# Altium schematic sheet 05) SAMA5D27SOM.SchDoc
size B; CompanyName: Microchip Technology Inc.; Organization: Microchip Technology; Address1: 2355 West Chandler Blvd.; Address2: Chandler, AZ  85224; Address4: USA; DocumentNumber: 5; SheetNumber: 5; SheetTotal: 9; SheetTitle: **; Time: Time
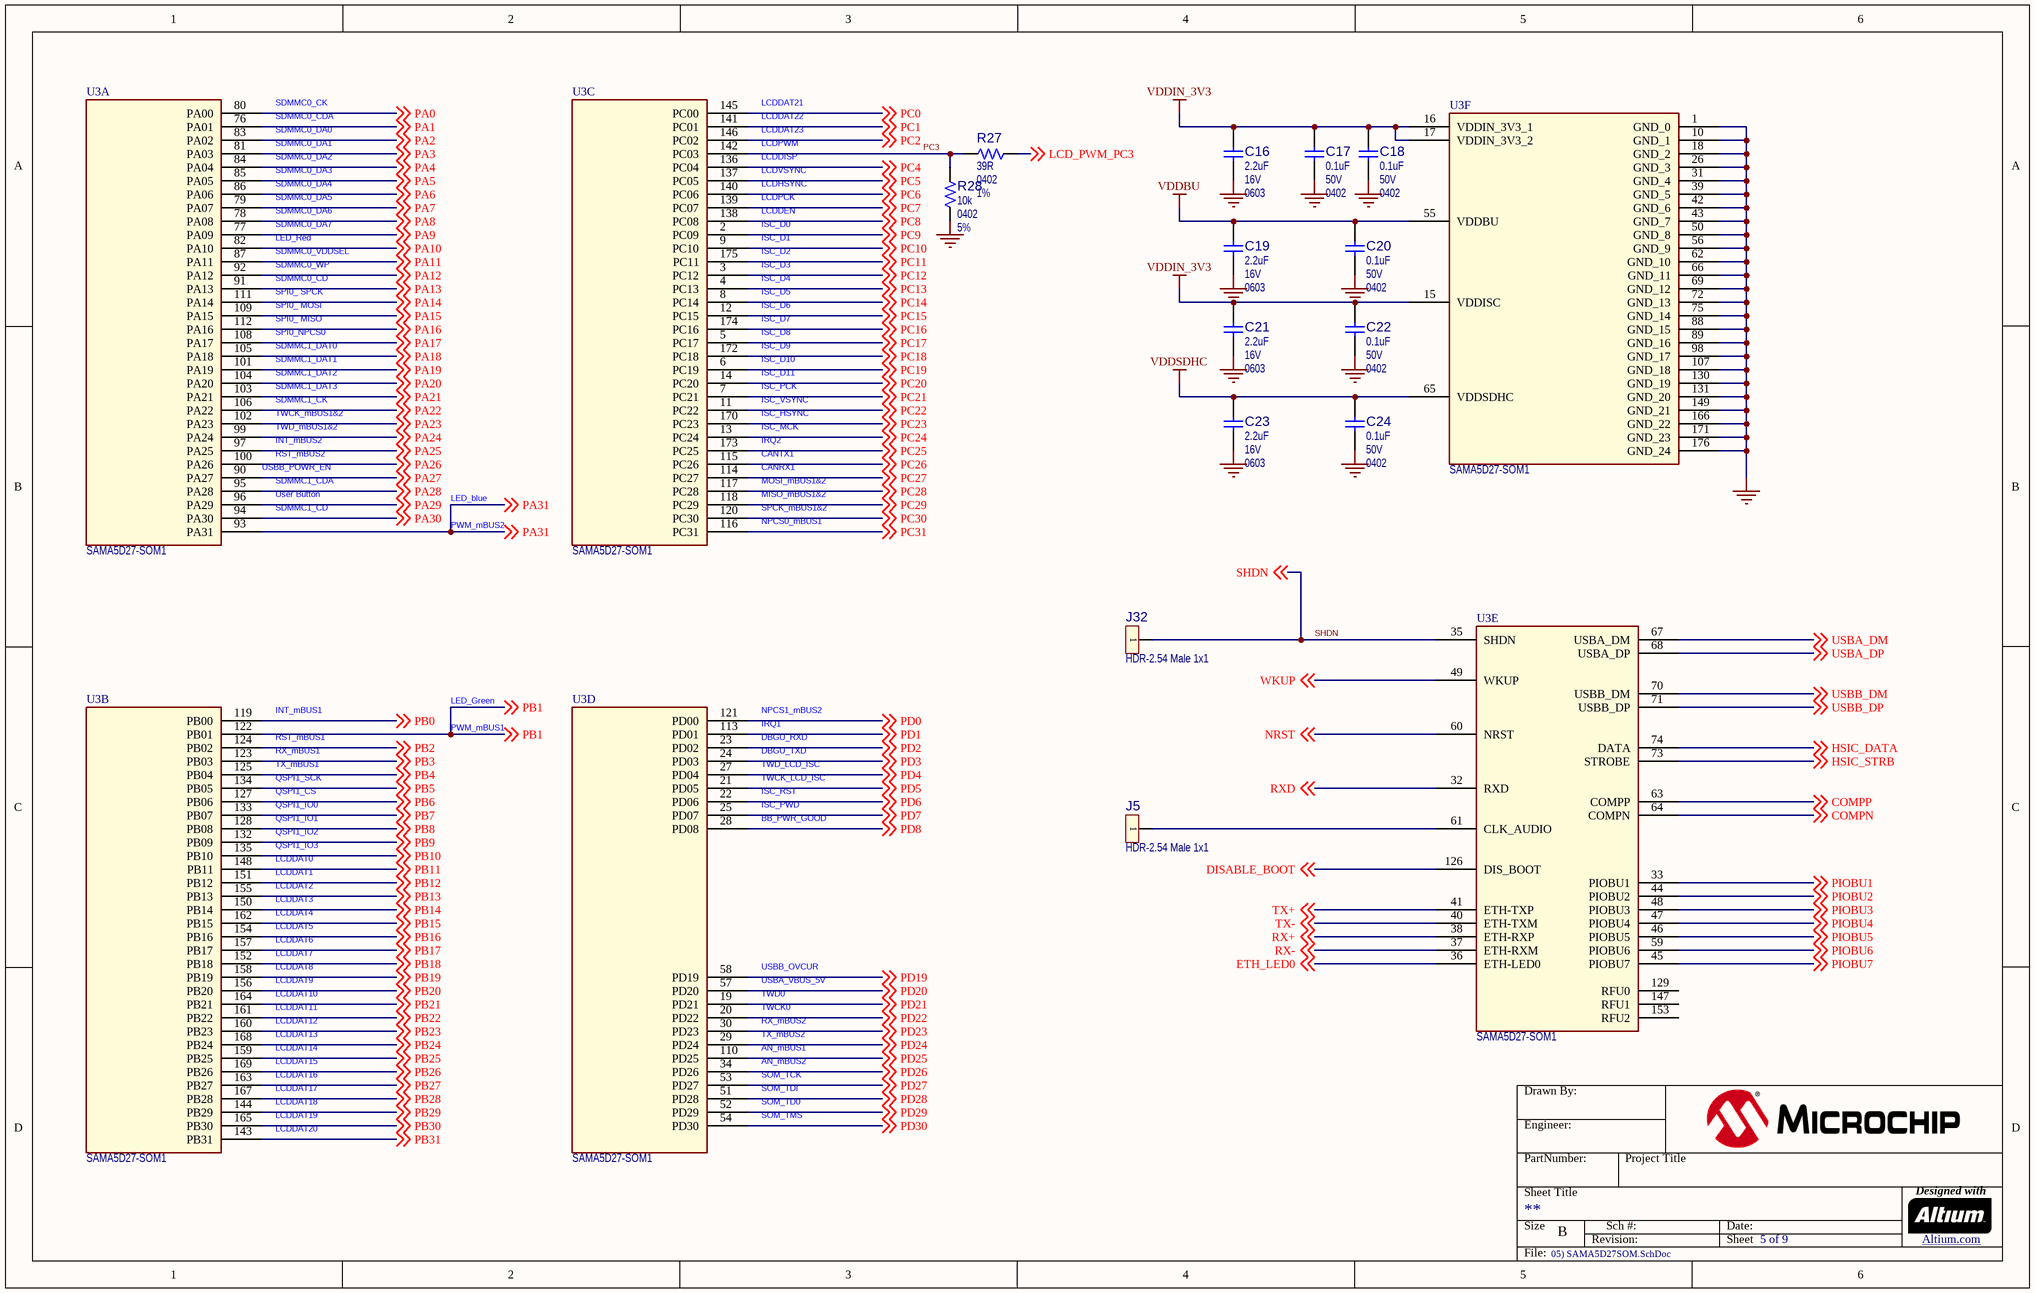
[diagram p0: 05) SAMA5D27SOM.SchDoc]

## Parts
?  (no value)  (graphical)
C16  value 2.2uF  Voltage: 16V  Package: 0603  [CAP_C_0603]  (hidden comment: Capacitor NP)
C17  value 0.1uF  Voltage: 50V  Package: 0402  [CAP_C_0402]  (hidden comment: Capacitor NP)
C18  value 0.1uF  Voltage: 50V  Package: 0402  [CAP_C_0402]  (hidden comment: Capacitor NP)
C19  value 2.2uF  Voltage: 16V  Package: 0603  [CAP_C_0603]  (hidden comment: Capacitor NP)
C20  value 0.1uF  Voltage: 50V  Package: 0402  [CAP_C_0402]  (hidden comment: Capacitor NP)
C21  value 2.2uF  Voltage: 16V  Package: 0603  [CAP_C_0603]  (hidden comment: Capacitor NP)
C22  value 0.1uF  Voltage: 50V  Package: 0402  [CAP_C_0402]  (hidden comment: Capacitor NP)
C23  value 2.2uF  Voltage: 16V  Package: 0603  [CAP_C_0603]  (hidden comment: Capacitor NP)
C24  value 0.1uF  Voltage: 50V  Package: 0402  [CAP_C_0402]  (hidden comment: Capacitor NP)
J5  value HDR-2.54 Male 1x1  [HDR_M_2.54_1x1]  (hidden comment: Header 1x1)
J32  value HDR-2.54 Male 1x1  [HDR_M_2.54_1x1]  (hidden comment: Header 1x1)
R27  value 39R  Package: 0402  Tolerance: 1%  [RES_C_0402]  (hidden comment: Resistor)
R28  value 10k  Package: 0402  Tolerance: 5%  [RES_C_0402]  (hidden comment: Resistor)
U3  value SAMA5D27-SOM1  [MOD SOM SAMA5D27-SOM1 40MMX38MM]  (hidden comment: *)  (parts A,B,C,D,E,F of 6)

## Nets
GND_POWER: C16.2 C17.2 C18.2 C19.2 C20.2 C21.2 C22.2 C23.2 C24.2 R28.2 U3.1(GND_0) U3.10(GND_1) U3.18(GND_2) U3.26(GND_3) U3.31(GND_4) U3.39(GND_5) U3.42(GND_6) U3.43(GND_7) U3.50(GND_8) U3.56(GND_9) U3.62(GND_10) U3.66(GND_11) U3.69(GND_12) U3.72(GND_13) U3.75(GND_14) U3.88(GND_15) U3.89(GND_16) U3.98(GND_17) U3.107(GND_18) U3.130(GND_19) U3.131(GND_20) U3.149(GND_21) U3.166(GND_22) U3.171(GND_23) U3.176(GND_24)
VDDBU: C19.1 C20.1 U3.55(VDDBU)
VDDIN_3V3: C16.1 C17.1 C18.1 C21.1 C22.1 U3.15(VDDISC) U3.16(VDDIN_3V3_1) U3.17(VDDIN_3V3_2)
VDDSDHC: C23.1 C24.1 U3.65(VDDSDHC)
COMPN: U3.64(COMPN) ; off-sheet COMPN
COMPP: U3.63(COMPP) ; off-sheet COMPP
DISABLE_BOOT: U3.126(DIS_BOOT) ; off-sheet DISABLE_BOOT
ETH_LED0: U3.36(ETH-LED0) ; off-sheet ETH_LED0
HSIC_DATA: U3.74(DATA) ; off-sheet HSIC_DATA
HSIC_STRB: U3.73(STROBE) ; off-sheet HSIC_STRB
LCD_PWM_PC3: R27.2 ; off-sheet LCD_PWM_PC3
NRST: U3.60(NRST) ; off-sheet NRST
PA0: U3.80(PA00) ; off-sheet PA0
PA1: U3.76(PA01) ; off-sheet PA1
PA2: U3.83(PA02) ; off-sheet PA2
PA3: U3.81(PA03) ; off-sheet PA3
PA4: U3.84(PA04) ; off-sheet PA4
PA5: U3.85(PA05) ; off-sheet PA5
PA6: U3.86(PA06) ; off-sheet PA6
PA7: U3.79(PA07) ; off-sheet PA7
PA8: U3.78(PA08) ; off-sheet PA8
PA9: U3.77(PA09) ; off-sheet PA9
PA10: U3.82(PA10) ; off-sheet PA10
PA11: U3.87(PA11) ; off-sheet PA11
PA12: U3.92(PA12) ; off-sheet PA12
PA13: U3.91(PA13) ; off-sheet PA13
PA14: U3.111(PA14) ; off-sheet PA14
PA15: U3.109(PA15) ; off-sheet PA15
PA16: U3.112(PA16) ; off-sheet PA16
PA17: U3.108(PA17) ; off-sheet PA17
PA18: U3.105(PA18) ; off-sheet PA18
PA19: U3.101(PA19) ; off-sheet PA19
PA20: U3.104(PA20) ; off-sheet PA20
PA21: U3.103(PA21) ; off-sheet PA21
PA22: U3.106(PA22) ; off-sheet PA22
PA23: U3.102(PA23) ; off-sheet PA23
PA24: U3.99(PA24) ; off-sheet PA24
PA25: U3.97(PA25) ; off-sheet PA25
PA26: U3.100(PA26) ; off-sheet PA26
PA27: U3.90(PA27) ; off-sheet PA27
PA28: U3.95(PA28) ; off-sheet PA28
PA29: U3.96(PA29) ; off-sheet PA29
PA30: U3.94(PA30) ; off-sheet PA30
PA31: U3.93(PA31) ; off-sheet PA31
PB0: U3.119(PB00) ; off-sheet PB0
PB1: U3.122(PB01) ; off-sheet PB1
PB2: U3.124(PB02) ; off-sheet PB2
PB3: U3.123(PB03) ; off-sheet PB3
PB4: U3.125(PB04) ; off-sheet PB4
PB5: U3.134(PB05) ; off-sheet PB5
PB6: U3.127(PB06) ; off-sheet PB6
PB7: U3.133(PB07) ; off-sheet PB7
PB8: U3.128(PB08) ; off-sheet PB8
PB9: U3.132(PB09) ; off-sheet PB9
PB10: U3.135(PB10) ; off-sheet PB10
PB11: U3.148(PB11) ; off-sheet PB11
PB12: U3.151(PB12) ; off-sheet PB12
PB13: U3.155(PB13) ; off-sheet PB13
PB14: U3.150(PB14) ; off-sheet PB14
PB15: U3.162(PB15) ; off-sheet PB15
PB16: U3.154(PB16) ; off-sheet PB16
PB17: U3.157(PB17) ; off-sheet PB17
PB18: U3.152(PB18) ; off-sheet PB18
PB19: U3.158(PB19) ; off-sheet PB19
PB20: U3.156(PB20) ; off-sheet PB20
PB21: U3.164(PB21) ; off-sheet PB21
PB22: U3.161(PB22) ; off-sheet PB22
PB23: U3.160(PB23) ; off-sheet PB23
PB24: U3.168(PB24) ; off-sheet PB24
PB25: U3.159(PB25) ; off-sheet PB25
PB26: U3.169(PB26) ; off-sheet PB26
PB27: U3.163(PB27) ; off-sheet PB27
PB28: U3.167(PB28) ; off-sheet PB28
PB29: U3.144(PB29) ; off-sheet PB29
PB30: U3.165(PB30) ; off-sheet PB30
PB31: U3.143(PB31) ; off-sheet PB31
PC0: U3.145(PC00) ; off-sheet PC0
PC1: U3.141(PC01) ; off-sheet PC1
PC2: U3.146(PC02) ; off-sheet PC2
PC3: R27.1 R28.1 U3.142(PC03)
PC4: U3.136(PC04) ; off-sheet PC4
PC5: U3.137(PC05) ; off-sheet PC5
PC6: U3.140(PC06) ; off-sheet PC6
PC7: U3.139(PC07) ; off-sheet PC7
PC8: U3.138(PC08) ; off-sheet PC8
PC9: U3.2(PC09) ; off-sheet PC9
PC10: U3.9(PC10) ; off-sheet PC10
PC11: U3.175(PC11) ; off-sheet PC11
PC12: U3.3(PC12) ; off-sheet PC12
PC13: U3.4(PC13) ; off-sheet PC13
PC14: U3.8(PC14) ; off-sheet PC14
PC15: U3.12(PC15) ; off-sheet PC15
PC16: U3.174(PC16) ; off-sheet PC16
PC17: U3.5(PC17) ; off-sheet PC17
PC18: U3.172(PC18) ; off-sheet PC18
PC19: U3.6(PC19) ; off-sheet PC19
PC20: U3.14(PC20) ; off-sheet PC20
PC21: U3.7(PC21) ; off-sheet PC21
PC22: U3.11(PC22) ; off-sheet PC22
PC23: U3.170(PC23) ; off-sheet PC23
PC24: U3.13(PC24) ; off-sheet PC24
PC25: U3.173(PC25) ; off-sheet PC25
PC26: U3.115(PC26) ; off-sheet PC26
PC27: U3.114(PC27) ; off-sheet PC27
PC28: U3.117(PC28) ; off-sheet PC28
PC29: U3.118(PC29) ; off-sheet PC29
PC30: U3.120(PC30) ; off-sheet PC30
PC31: U3.116(PC31) ; off-sheet PC31
PD0: U3.121(PD00) ; off-sheet PD0
PD1: U3.113(PD01) ; off-sheet PD1
PD2: U3.23(PD02) ; off-sheet PD2
PD3: U3.24(PD03) ; off-sheet PD3
PD4: U3.27(PD04) ; off-sheet PD4
PD5: U3.21(PD05) ; off-sheet PD5
PD6: U3.22(PD06) ; off-sheet PD6
PD7: U3.25(PD07) ; off-sheet PD7
PD8: U3.28(PD08) ; off-sheet PD8
PD19: U3.58(PD19) ; off-sheet PD19
PD20: U3.57(PD20) ; off-sheet PD20
PD21: U3.19(PD21) ; off-sheet PD21
PD22: U3.20(PD22) ; off-sheet PD22
PD23: U3.30(PD23) ; off-sheet PD23
PD24: U3.29(PD24) ; off-sheet PD24
PD25: U3.110(PD25) ; off-sheet PD25
PD26: U3.34(PD26) ; off-sheet PD26
PD27: U3.53(PD27) ; off-sheet PD27
PD28: U3.51(PD28) ; off-sheet PD28
PD29: U3.52(PD29) ; off-sheet PD29
PD30: U3.54(PD30) ; off-sheet PD30
PIOBU1: U3.33(PIOBU1) ; off-sheet PIOBU1
PIOBU2: U3.44(PIOBU2) ; off-sheet PIOBU2
PIOBU3: U3.48(PIOBU3) ; off-sheet PIOBU3
PIOBU4: U3.47(PIOBU4) ; off-sheet PIOBU4
PIOBU5: U3.46(PIOBU5) ; off-sheet PIOBU5
PIOBU6: U3.59(PIOBU6) ; off-sheet PIOBU6
PIOBU7: U3.45(PIOBU7) ; off-sheet PIOBU7
RX+: U3.38(ETH-RXP) ; off-sheet RX+
RX-: U3.37(ETH-RXM) ; off-sheet RX-
RXD: U3.32(RXD) ; off-sheet RXD
SHDN: J32.1 U3.35(SHDN) ; off-sheet SHDN
TX+: U3.41(ETH-TXP) ; off-sheet TX+
TX-: U3.40(ETH-TXM) ; off-sheet TX-
USBA_DM: U3.67(USBA_DM) ; off-sheet USBA_DM
USBA_DP: U3.68(USBA_DP) ; off-sheet USBA_DP
USBB_DM: U3.70(USBB_DM) ; off-sheet USBB_DM
USBB_DP: U3.71(USBB_DP) ; off-sheet USBB_DP
WKUP: U3.49(WKUP) ; off-sheet WKUP
NetJ5_1: J5.1 U3.61(CLK_AUDIO)

Not connected (* = marked no-connect by the designer): U3 129(RFU0) 147(RFU1) 153(RFU2)

## Notes on the sheet
- SDMMC0_DA1
- SDMMC0_DA0
- SDMMC0_CK
- SDMMC0_CDA
- SDMMC0_DA2
- LCDDAT22
- LCDDAT21
- LCDDAT23
- LCDPWM
- LCDDISP
- SDMMC0_DA4
- SDMMC0_DA5
- SDMMC0_DA6
- SDMMC0_DA7
- SDMMC0_DA3
- ISC_D0
- LCDDEN
- LCDHSYNC
- LCDVSYNC
- LCDPCK
- SDMMC0_CD
- SDMMC0_WP
- SPI0_ SPCK
- LED_Red
- SDMMC0_VDDSEL
- ISC_D5
- ISC_D3
- ISC_D1
- ISC_D4
- ISC_D2
- SDMMC1_DAT0
- SDMMC1_DAT1
- SPI0_ MOSI
- SPI0_ MISO
- SPI0_NPCS0
- ISC_D9
- ISC_D7
- ISC_D10
- ISC_D8
- ISC_D6
- SDMMC1_CK
- SDMMC1_DAT3
- SDMMC1_DAT2
- TWD_mBUS1&2
- TWCK_mBUS1&2
- ISC_D11
- ISC_PCK
- ISC_HSYNC
- ISC_VSYNC
- ISC_MCK
- (near U3) USBB_POWR_EN
- SDMMC1_CDA
- INT_mBUS2
- RST_mBUS2
- User Button
- LED_blue
- IRQ2
- MISO_mBUS1&2
- MOSI_mBUS1&2
- CANTX1
- CANRX1
- SDMMC1_CD
- PWM_mBUS2
- SPCK_mBUS1&2
- NPCS0_mBUS1
- LED_Green
- TX_mBUS1
- RX_mBUS1
- INT_mBUS1
- RST_mBUS1
- PWM_mBUS1
- TWD_LCD_ISC
- IRQ1
- NPCS1_mBUS2
- DBGU_TXD
- DBGU_RXD
- QSPI1_SCK
- QSPI1_CS
- QSPI1_IO0
- QSPI1_IO1
- QSPI1_IO2
- ISC_RST
- ISC_PWD
- TWCK_LCD_ISC
- BB_PWR_GOOD
- QSPI1_IO3
- LCDDAT0
- LCDDAT3
- LCDDAT2
- LCDDAT1
- LCDDAT6
- LCDDAT5
- LCDDAT4
- LCDDAT8
- LCDDAT7
- USBB_OVCUR
- LCDDAT11
- LCDDAT10
- LCDDAT9
- LCDDAT13
- LCDDAT12
- USBA_VBUS_5V
- TX_mBUS2
- RX_mBUS2
- TWD0
- TWCK0
- LCDDAT16
- LCDDAT15
- LCDDAT14
- LCDDAT18
- LCDDAT17
- AN_mBUS2
- AN_mBUS1
- SOM_TDI
- SOM_TD0
- SOM_TCK
- LCDDAT20
- LCDDAT19
- SOM_TMS
- Drawn By:
- Engineer:
- PartNumber:
- Project Title
- Sheet Title
- Size
- B
- Revision:
- Sch #:
- Date:
- Sheet
- Designed with
- Altium.com <http://go.altium.com/MicrochipLandingPage_Evaluation.html>
- File:

## Library data of the parts
? = Title Block B
C16 C19 C21 C23 = CAP0597: Capacitor; Manufacturer 1: TDK; Manufacturer Part Number 1: C1608X5R1C225K; Description_: CAP CER 2.2uF 16V 10% X5R SMD 0603; Dev Tools Status: Production; Tolerance: 10%; Temperature Coeffcient: X5R; Type: Ceramic; Populated: DNP; MCHP-ID: CAP0597; Revision: 2; Symbol: Capacitor NP; Status: MCL Design; ComponentLink1URL: https://chn-vm-apps.microchip.com/mchprepo/parts/Datasheets/general_B11.pdf; ComponentLink1Description: SVN Datasheet; ComponentLink2URL: C:\ALTIUM_WORK\00001_MCHP-CDB\Datasheets\general_B11.pdf; ComponentLink2Description: Local Datasheet; ComponentLink3URL: C:\ALTIUM_WORK\00001_MCHP-CDB\Library\LibraryRefs\Capacitor NP.SchLib; ComponentLink3Description: Open Symbol; ComponentLink4URL: C:\ALTIUM_WORK\00001_MCHP-CDB\Library\Footprints\CAP_C_0603.PcbLib; ComponentLink4Description: Open Footprint; ComponentLink5Description: Open Footprint 2; ComponentLink6Description: Open Footprint 3; ComponentLink7Description: Open Footprint 4; Operating Temperature: -55C to +85C; Category: Capacitor; Supplier 1: Digi-Key; Supplier Part Number 1: 445-5157-1-ND; Quantity Override: 1
C17 C18 C20 C22 C24 = CAP1463: Capacitor; Manufacturer 1: TDK Corporation; Manufacturer Part Number 1: C1005X7R1H104K050BB; Description_: CAP CER 0.1uF 50V 10% X7R SMD 0402; Dev Tools Status: Production; Tolerance: 10%; Temperature Coeffcient: X7R; Type: Ceramic; Owner: Jamus Griego; Populated: YES; MCHP-ID: CAP1463; Revision: 1; Symbol: Capacitor NP; Status: MCL Design; ComponentLink1URL: https://chn-vm-apps.microchip.com/mchprepo/parts/Datasheets/TDKMLCCCapRange.pdf; ComponentLink1Description: SVN Datasheet; ComponentLink2URL: C:\ALTIUM_WORK\00001_MCHP-CDB\Datasheets\TDKMLCCCapRange.pdf; ComponentLink2Description: Local Datasheet; ComponentLink3URL: C:\ALTIUM_WORK\00001_MCHP-CDB\Library\LibraryRefs\Capacitor NP.SchLib; ComponentLink3Description: Open Symbol; ComponentLink4URL: C:\ALTIUM_WORK\00001_MCHP-CDB\Library\Footprints\CAP_C_0402.PcbLib; ComponentLink4Description: Open Footprint; ComponentLink5Description: Open Footprint 2; ComponentLink6Description: Open Footprint 3; ComponentLink7Description: Open Footprint 4; Operating Temperature: -55C to +125C; Category: Capacitor; Supplier 1: Digi-Key; Supplier Part Number 1: 445-5932-1-ND; Quantity Override: 1
J5 J32 = CON0182: CON HDR-2.54 Male 1x1 Gold 5.97MH TH VERT; Manufacturer 1: Nextron; Manufacturer Part Number 1: 211-0111-0021-400; Dev Tools Status: Production; Populated: DNP; MCHP-ID: CON0182; Revision: 3; Symbol: Header 1x1; Description_: CON HDR-2.54 Male 1x1 Gold 5.97MH TH VERT; Status: MCL Design; ComponentLink1URL: https://chn-vm-apps.microchip.com/mchprepo/parts/Datasheets/TSW-XXX-XX-XXX-X-XX-XXX-MKT.pdf; ComponentLink1Description: SVN Datasheet; ComponentLink2URL: C:\ALTIUM_WORK\00001_MCHP-CDB\Datasheets\TSW-XXX-XX-XXX-X-XX-XXX-MKT.pdf; ComponentLink2Description: Local Datasheet; ComponentLink3URL: C:\ALTIUM_WORK\00001_MCHP-CDB\Library\LibraryRefs\Header 1x1.SchLib; ComponentLink3Description: Open Symbol; ComponentLink4URL: C:\ALTIUM_WORK\00001_MCHP-CDB\Library\Footprints\HDR_M_2.54_1x1.PcbLib; ComponentLink4Description: Open Footprint; ComponentLink5Description: Open Footprint 2; ComponentLink6Description: Open Footprint 3; ComponentLink7Description: Open Footprint 4; Type: Header 2.54mm; Category: Connector; Manufacturer 2: Samtec; Manufacturer Part Number 2: TSW-101-07-G-S; Manufacturer 3: Samtec; Manufacturer Part Number 3: TSW-101-07-L-S; Manufacturer 4: Samtec; Manufacturer Part Number 4: TSW-101-07-S-S; Supplier 1: Raynen; Supplier Part Number 1: CONN00405E01M; Supplier 2: Samtec; Supplier Part Number 2: TSW-101-07-G-S; Supplier 3: Samtec; Supplier Part Number 3: TSW-101-07-L-S; Supplier 4: Samtec; Supplier Part Number 4: TSW-101-07-S-S; Quantity Override: 1
R27 = RES1800: Manufacturer 1: Yageo; Manufacturer Part Number 1: RC0402FR-0739RL; Description_: RES TKF 39R 1% 1/16W SMD 0402; Dev Tools Status: Design; Circuit Type: Single; Power: 1/16W; Owner: Sompoch Loboonlert; Populated: YES; MCHP-ID: RES1800; Revision: B; Symbol: Resistor; Status: MCL Design; ComponentLink1URL: https://chn-vm-apps.microchip.com/mchprepo/parts/Datasheets/PYu-R_INT-thick_7.pdf; ComponentLink1Description: SVN Datasheet; ComponentLink2URL: C:\ALTIUM_WORK\00001_MCHP-CDB\Datasheets\PYu-R_INT-thick_7.pdf; ComponentLink2Description: Local Datasheet; ComponentLink3URL: C:\ALTIUM_WORK\00001_MCHP-CDB\Library\LibraryRefs\Resistor.SchLib; ComponentLink3Description: Open Symbol; ComponentLink4URL: C:\ALTIUM_WORK\00001_MCHP-CDB\Library\Footprints\RES_C_0402.PcbLib; ComponentLink4Description: Open Footprint; ComponentLink5Description: Open Footprint 2; ComponentLink6Description: Open Footprint 3; ComponentLink7Description: Open Footprint 4; Operating Temperature: -55°C ~ 155°C; Category: Resistor; Type: RES SMD; Composition: TKF; Manufacturer 2: Digi-Key; Manufacturer Part Number 2: 311-39.0LRCT-ND; Supplier 1: Yageo; Supplier Part Number 1: RC0402FR-0739RL; Supplier 2: Digi-Key; Supplier Part Number 2: 311-39.0LRCT-ND; Quantity Override: 1
R28 = RSMT0439: Manufacturer 1: Vishay; Manufacturer Part Number 1: CRCW040210K0JNED; Description_: RES TKF 10k 5% 1/16W SMD 0402; Dev Tools Status: Production; Voltage: 50V; Temperature Coeffcient: 100ppm/C; Power: 1/16W; Populated: Yes; MCHP-ID: RSMT0439; Revision: 1; Symbol: Resistor; Status: MCL Design; ComponentLink1URL: https://chn-vm-apps.microchip.com/mchprepo/parts/Datasheets/PYu-RC0402_51_RoHS_L_6.pdf; ComponentLink1Description: SVN Datasheet; ComponentLink2URL: C:\ALTIUM_WORK\00001_MCHP-CDB\Datasheets\PYu-RC0402_51_RoHS_L_6.pdf; ComponentLink2Description: Local Datasheet; ComponentLink3URL: C:\ALTIUM_WORK\00001_MCHP-CDB\Library\LibraryRefs\Resistor.SchLib; ComponentLink3Description: Open Symbol; ComponentLink4URL: C:\ALTIUM_WORK\00001_MCHP-CDB\Library\Footprints\RES_C_0402.PcbLib; ComponentLink4Description: Open Footprint; ComponentLink5Description: Open Footprint 2; ComponentLink6Description: Open Footprint 3; ComponentLink7Description: Open Footprint 4; Operating Temperature: -55C to +155C; Category: Resistor; Type: RES SMD; Composition: TKF; Manufacturer 2: Yageo; Manufacturer Part Number 2: RC0402JR-0710KL; Supplier 1: Digi-Key; Supplier Part Number 1: 541-10KJCT-ND; Supplier 2: Digi-Key; Supplier Part Number 2: 311-10KJRCT-ND; Quantity Override: 1
U3 = MIC7283: MCHP MCU 32-BIT SOM 500MHz 128kB ETHERNET EEPROM ATSAMA5D27-SOM1 MODULE; Manufacturer 1: Microchip Production; Dev Tools Status: Design; Owner: Dragos Danaila; Populated: YES; MCHP-ID: MIC7283; Description_: MCHP MCU 32-BIT SOM 500MHz 128kB ETHERNET EEPROM ATSAMA5D27-SOM1 MODULE; Symbol: MOD SOM SAMA5D27-DXG-SOM1 40x38mm; Type: 32-Bit System-on-Module; Status: MCL Design; Revision: A; Category: MCHP-Microcontroller; ComponentLink1Description: SVN Datasheet; ComponentLink2URL: C:\ALTIUM_WORK\00001_MCHP-CDB\Datasheets\N/A; ComponentLink2Description: Local Datasheet; ComponentLink3URL: C:\ALTIUM_WORK\00001_MCHP-CDB\Library\LibraryRefs\MOD SOM SAMA5D27-DXG-SOM1 40x38mm.SchLib; ComponentLink3Description: Open Symbol; ComponentLink4URL: C:\ALTIUM_WORK\00001_MCHP-CDB\Library\Footprints\MOD SOM SAMA5D27-SOM1 40MMX38MM.PcbLib; ComponentLink4Description: Open Footprint; ComponentLink5Description: Open Footprint 2; ComponentLink6Description: Open Footprint 3; ComponentLink7Description: Open Footprint 4; Manufacturer Part Number 1: ATSAMA5D27-SOM1; Supplier 1: Microchip Production; Supplier Part Number 1: ATSAMA5D27-SOM1; Quantity Override: 1